# EAGLE design 2_disp (EAGLE 6.4)
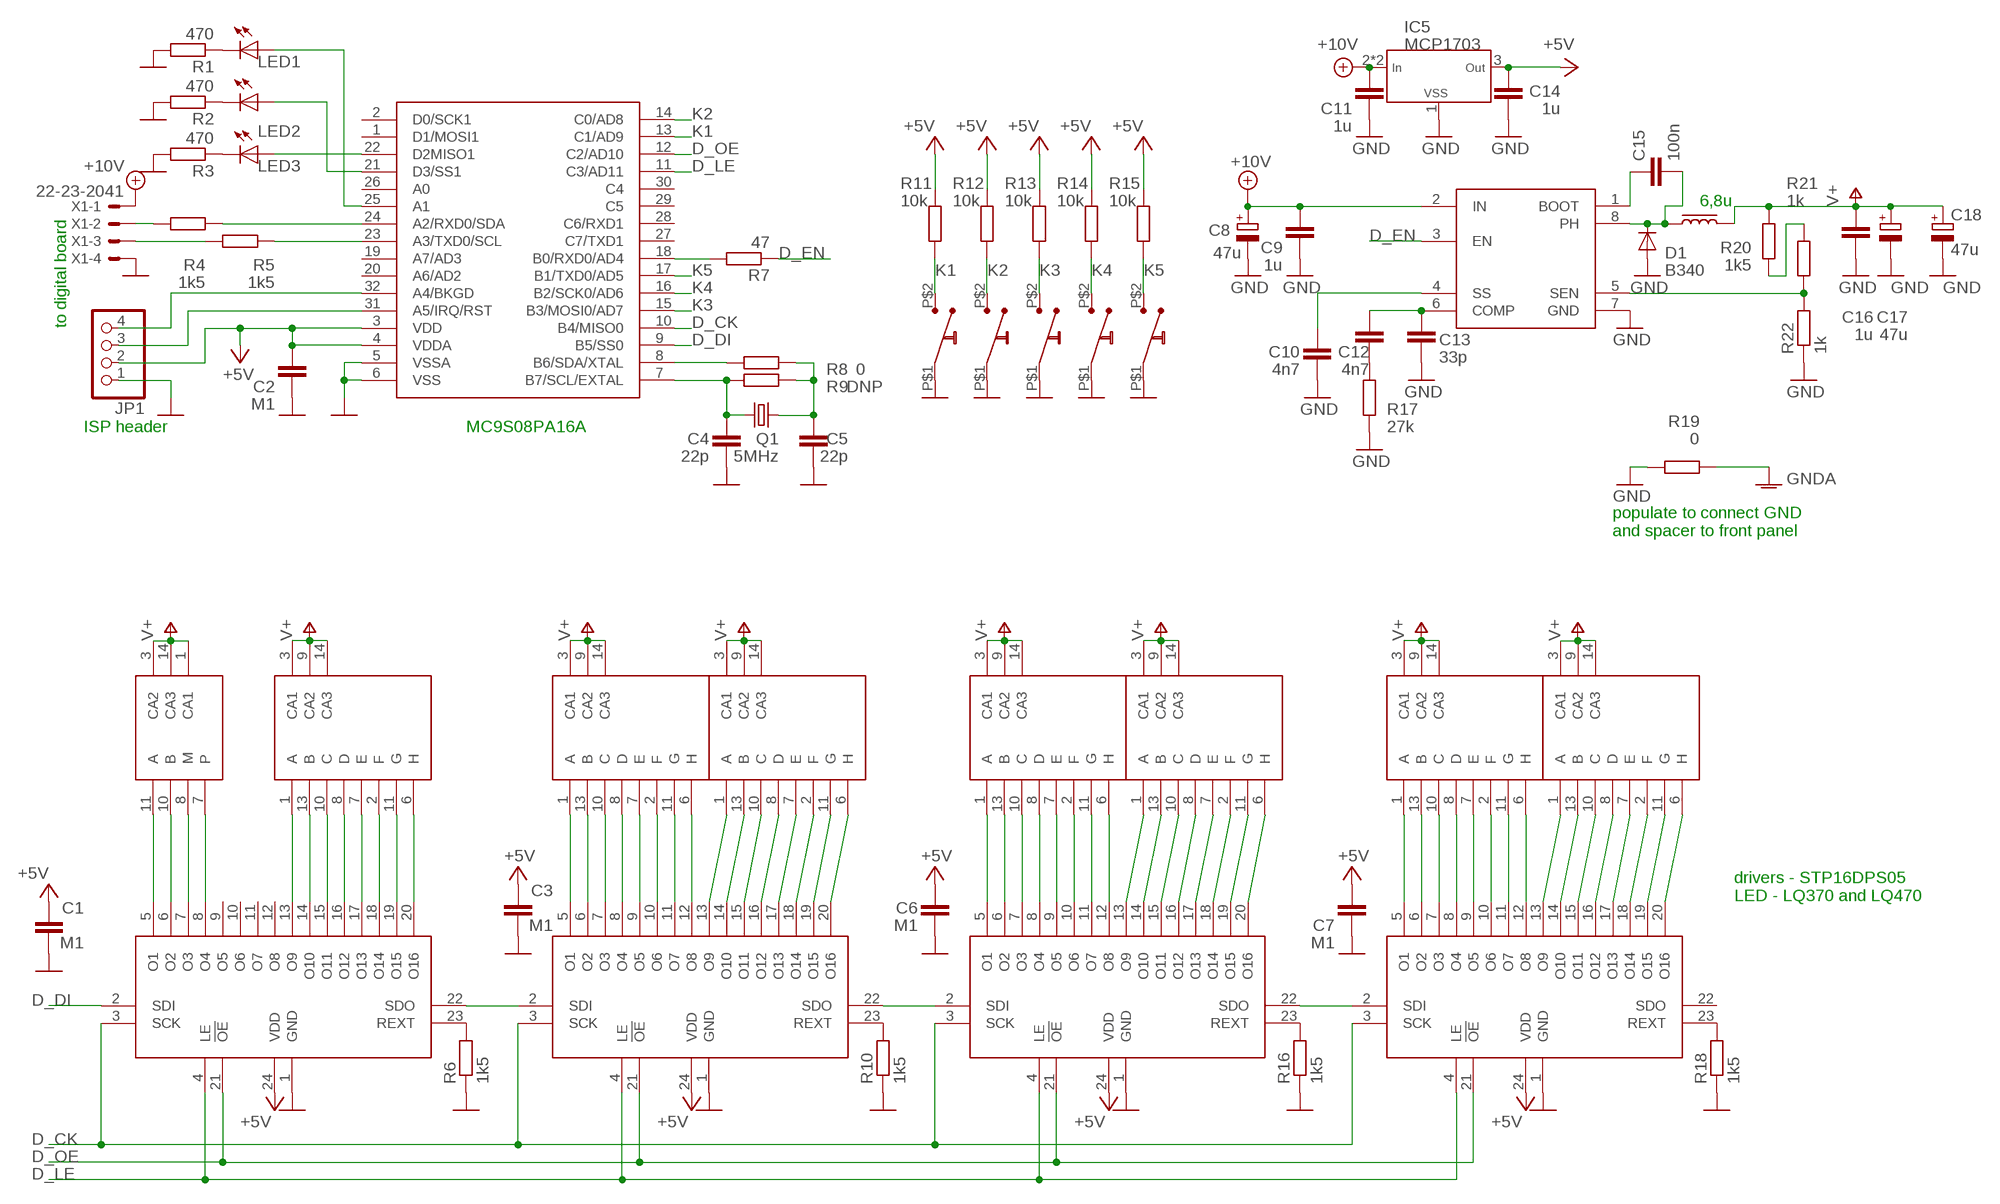
[diagram p0: schematic, sheet 1]

## Parts
C1  M1  C_0806  [R0805]
C2  M1  C_0806  [R0805]
C3  M1  C_0806  [R0805]
C4  22p  C_0806  [R0805]
C5  22p  C_0806  [R0805]
C6  M1  C_0806  [R0805]
C7  M1  C_0806  [R0805]
C8  47u  CPOL-EUSMCC  [SMC_C]
C9  1u  C_0806  [R0805]
C10  4n7  C_0806  [R0805]
C11  1u  C_0806  [R0805]
C12  4n7  C_0806  [R0805]
C13  33p  C_0806  [R0805]
C14  1u  C_0806  [R0805]
C15  100n  C_0806  [R0805]
C16  1u  C_0806  [R0805]
C17  47u  CPOL-EUSMCC  [SMC_C]
C18  47u  CPOL-EUSMCC  [SMC_C]
D1  B340  DIODE-SMB  [SMB]
DI1  LQ3XX  [LQ_DISP]
DI2  LQ4XX  [LQ_DISP]
DI3  LQ4XX  [LQ_DISP]
DI4  LQ4XX  [LQ_DISP]
DI5  LQ4XX  [LQ_DISP]
DI6  LQ4XX  [LQ_DISP]
DI7  LQ4XX  [LQ_DISP]
DI8  LQ4XX  [LQ_DISP]
IC1  STP16CPS05  [QSOP24]
IC2  MC9S08PT60TQ32  [TQFP32-8]
IC3  STP16CPS05  [QSOP24]
IC4  STP16CPS05  [QSOP24]
IC5  MCP1703  MCP1702-SOT89  [SOT89]
IC6  STP16CPS05  [QSOP24]
IC7  TPS54331  [SO-08]
JP1  PINHD-1X04_2.54  [1X04]
K1  SWITCH_MINI6450  [SWITCH_6450]
K2  SWITCH_MINI6450  [SWITCH_6450]
K3  SWITCH_MINI6450  [SWITCH_6450]
K4  SWITCH_MINI6450  [SWITCH_6450]
K5  SWITCH_MINI6450  [SWITCH_6450]
L1  SRP7030  INDUCTORBOURNS_SRP7030  [BOURNS_SRP7030]
LED1  LEDCHIPLED_0805  [CHIPLED_0805]
LED2  LEDCHIPLED_1206  [CHIPLED_1206]
LED3  LEDCHIPLED_1206  [CHIPLED_1206]
Q1  5MHz  CRYSTALTC38H  [TC38H]
R1  470  R_0805  [R0805]
R2  470  R_0805  [R0805]
R3  470  R_0805  [R0805]
R4  1k5  R_0805  [R0805]
R5  1k5  R_0805  [R0805]
R6  1k5  R_0805  [R0805]
R7  47  R_0805  [R0805]
R8  0  R_0805  [R0805]
R9  DNP  R_0805  [R0805]
R10  1k5  R_0805  [R0805]
R11  10k  R_0805  [R0805]
R12  10k  R_0805  [R0805]
R13  10k  R_0805  [R0805]
R14  10k  R_0805  [R0805]
R15  10k  R_0805  [R0805]
R16  1k5  R_0805  [R0805]
R17  27k  R_0805  [R0805]
R18  1k5  R_0805  [R0805]
R19  0  R_0805  [R0805]
R20  1k5  R_0805  [R0805]
R21  1k  R_0805  [R0805]
R22  1k  R_0805  [R0805]
X1  22-23-2041  [22-23-2041]

## Nets
+5V: C1.2 C2.2 C3.2 C6.2 C7.2 C14.2 IC1.24(VDD) IC2.3(VDD) IC2.4(VDDA) IC3.24(VDD) IC4.24(VDD) IC5.3(OUT) IC6.24(VDD) JP1.2 R11.1 R12.1 R13.1 R14.1 R15.1
+10V: C8.+ C9.2 C11.2 IC5.2(IN) IC5.2@1(IN) IC7.2(IN) X1.1
D_CK: IC1.3(SCK) IC2.10(B4/MISO0) IC3.3(SCK) IC4.3(SCK) IC6.3(SCK)
D_DI: IC1.2(SDI) IC2.9(B5/SS0)
D_EN: IC7.3(EN) R7.1
D_LE: IC1.4(LE) IC2.11(C3/AD11) IC3.4(LE) IC4.4(LE) IC6.4(LE)
D_OE: IC1.21(!OE) IC2.12(C2/AD10) IC3.21(!OE) IC4.21(!OE) IC6.21(!OE)
GND: C1.1 C2.1 C3.1 C4.1 C5.1 C6.1 C7.1 C8.- C9.1 C10.1 C11.1 C13.1 C14.1 C16.1 C17.- C18.- D1.A IC1.1(GND) IC2.5(VSSA) IC2.6(VSS) IC3.1(GND) IC4.1(GND) IC5.1(VSS) IC6.1(GND) IC7.7(GND) JP1.1 K1.P$1 K2.P$1 K3.P$1 K4.P$1 K5.P$1 R1.2 R2.2 R3.2 R6.1 R10.1 R16.1 R17.1 R18.1 R19.2 R22.1 X1.4
GNDA: R19.1
K1: IC2.13(C1/AD9) K1.P$2 R11.2
K2: IC2.14(C0/AD8) K2.P$2 R12.2
K3: IC2.15(B3/MOSI0/AD7) K3.P$2 R13.2
K4: IC2.16(B2/SCK0/AD6) K4.P$2 R14.2
K5: IC2.17(B1/TXD0/AD5) K5.P$2 R15.2
N$5: DI1.11(A) IC1.5(O1)
N$6: DI1.10(B) IC1.6(O2)
N$7: DI1.8(M) IC1.7(O3)
N$8: DI1.7(P) IC1.8(O4)
N$9: DI2.1(A) IC1.13(O9)
N$10: DI2.13(B) IC1.14(O10)
N$11: DI2.10(C) IC1.15(O11)
N$12: DI2.8(D) IC1.16(O12)
N$13: DI2.7(E) IC1.17(O13)
N$14: DI2.2(F) IC1.18(O14)
N$15: DI2.11(G) IC1.19(O15)
N$16: DI2.6(H) IC1.20(O16)
N$17: DI3.1(A) IC3.5(O1)
N$18: DI3.13(B) IC3.6(O2)
N$19: DI3.10(C) IC3.7(O3)
N$20: DI3.8(D) IC3.8(O4)
N$21: IC3.23(REXT) R10.2
N$22: DI3.7(E) IC3.9(O5)
N$23: DI3.2(F) IC3.10(O6)
N$24: DI3.11(G) IC3.11(O7)
N$25: DI3.6(H) IC3.12(O8)
N$26: DI4.1(A) IC3.13(O9)
N$27: DI4.13(B) IC3.14(O10)
N$28: DI4.10(C) IC3.15(O11)
N$29: DI4.8(D) IC3.16(O12)
N$30: DI4.7(E) IC3.17(O13)
N$31: DI4.2(F) IC3.18(O14)
N$32: DI4.11(G) IC3.19(O15)
N$33: DI4.6(H) IC3.20(O16)
N$34: DI5.1(A) IC4.5(O1)
N$35: DI5.13(B) IC4.6(O2)
N$36: DI5.10(C) IC4.7(O3)
N$37: DI5.8(D) IC4.8(O4)
N$38: IC4.23(REXT) R16.2
N$39: DI5.7(E) IC4.9(O5)
N$40: IC1.23(REXT) R6.2
N$41: DI5.2(F) IC4.10(O6)
N$42: DI5.11(G) IC4.11(O7)
N$43: DI5.6(H) IC4.12(O8)
N$44: DI6.1(A) IC4.13(O9)
N$45: DI6.13(B) IC4.14(O10)
N$46: DI6.10(C) IC4.15(O11)
N$47: DI6.8(D) IC4.16(O12)
N$48: DI6.7(E) IC4.17(O13)
N$49: DI6.2(F) IC4.18(O14)
N$50: DI6.11(G) IC4.19(O15)
N$51: DI6.6(H) IC4.20(O16)
N$52: DI7.1(A) IC6.5(O1)
N$53: DI7.13(B) IC6.6(O2)
N$54: DI7.10(C) IC6.7(O3)
N$55: DI7.8(D) IC6.8(O4)
N$56: IC6.23(REXT) R18.2
N$57: DI7.7(E) IC6.9(O5)
N$58: DI7.2(F) IC6.10(O6)
N$59: DI7.11(G) IC6.11(O7)
N$60: DI7.6(H) IC6.12(O8)
N$61: DI8.1(A) IC6.13(O9)
N$62: DI8.13(B) IC6.14(O10)
N$63: DI8.10(C) IC6.15(O11)
N$64: DI8.8(D) IC6.16(O12)
N$65: DI8.7(E) IC6.17(O13)
N$66: DI8.2(F) IC6.18(O14)
N$67: DI8.11(G) IC6.19(O15)
N$68: DI8.6(H) IC6.20(O16)
N$69: IC2.8(B6/SDA/XTAL) R8.2
N$70: C5.2 Q1.1 R8.1 R9.1
N$71: C4.2 IC2.7(B7/SCL/EXTAL) Q1.2 R9.2
N$72: IC2.18(B0/RXD0/AD4) R7.2
N$73: IC1.22(SDO) IC3.2(SDI)
N$74: IC3.22(SDO) IC4.2(SDI)
N$75: IC4.22(SDO) IC6.2(SDI)
N$76: LED2.C R2.1
N$77: IC2.23(A3/TXD0/SCL) R5.1
N$78: IC2.24(A2/RXD0/SDA) R4.1
N$79: R5.2 X1.3
N$80: R4.2 X1.2
N$81: IC2.32(A4/BKGD) JP1.4
N$82: IC2.31(A5/IRQ/RST) JP1.3
N$83: IC2.21(D3/SS1) LED2.A
N$84: LED1.C R1.1
N$85: C15.2 D1.C IC7.8(PH) L1.P$1
N$86: C15.1 IC7.1(BOOT)
N$87: IC2.25(A1) LED1.A
N$88: IC7.5(SEN) R21.1 R22.2
N$89: R20.1 R21.2
N$90: C12.1 R17.2
N$91: C12.2 C13.2 IC7.6(COMP)
N$92: C10.2 IC7.4(SS)
N$93: LED3.C R3.1
N$94: IC2.22(D2MISO1) LED3.A
V+: C16.2 C17.+ C18.+ DI1.1(CA1) DI1.3(CA2) DI1.14(CA3) DI2.3(CA1) DI2.9(CA2) DI2.14(CA3) DI3.3(CA1) DI3.9(CA2) DI3.14(CA3) DI4.3(CA1) DI4.9(CA2) DI4.14(CA3) DI5.3(CA1) DI5.9(CA2) DI5.14(CA3) DI6.3(CA1) DI6.9(CA2) DI6.14(CA3) DI7.3(CA1) DI7.9(CA2) DI7.14(CA3) DI8.3(CA1) DI8.9(CA2) DI8.14(CA3) L1.P$2 R20.2
Unconnected: IC1.9(O5) IC1.10(O6) IC1.11(O7) IC1.12(O8) IC2.1(D1/MOSI1) IC2.2(D0/SCK1) IC2.19(A7/AD3) IC2.20(A6/AD2) IC2.26(A0) IC2.27(C7/TXD1) IC2.28(C6/RXD1) IC2.29(C5) IC2.30(C4) IC6.22(SDO)

## Notes on the sheet
- 6,8u
- to digital board
- ISP header | MC9S08PA16A
- populate to connect GND 
  and spacer to front panel
- drivers - STP16DPS05
  LED - LQ370 and LQ470

## Library data of the parts
C1-C7 C9-C16 = _moja:C
C8 C17 C18 = _rcl:CPOL-EU: POLARIZED CAPACITOR, European symbol
D1 = diode:DIODE-: DIODE
DI1 = _jl4:LQ3XX
DI2-DI8 = _jl4:LQ4XX
IC1 IC3 IC4 IC6 = _moja:STP16CPS05
IC2 = _mcom6:MC9S08PT60
IC5 = _mcom6:MCP1702
IC7 = _mcom5:TPS54331
JP1 = pinhead-2:PINHD-1X04: PIN HEADER
K1-K5 = _moja:SWITCH_MINI
L1 = _mcs1:INDUCTOR
LED1-LED3 = led:LED: LED OSRAM: - CHIPLED LG R971, LG N971, LY N971, LG Q971, LY Q971, LO R971, LY R971 LH N974, LH R974 LS Q976, LO Q976, LY Q976 LO Q996 - Hyper CHIPLED LW Q18S LB Q993, LB Q99A, LB R99A - SideLED LS A670, LO A670, LY A670, LG A670, LP A670 LB A673, LV A673, LT A673, LW A673 LH A674 LY A675 LS A676, LA A676, LO A676, LY A676, LW A676 LS A679, LY A679, LG A679 - Hyper Micro SIDELED® LS Y876, LA Y876, LO Y876, LY Y876 LT Y87S - SmartLED LW L88C, LW L88S LB L89C, LB L89S, LG L890 LS L89K, LO L89K, LY L89K LS L896, LA L896, LO L896, LY L896 - TOPLED LS T670, LO T670, LY T670, LG T670, LP T670 LSG T670, LSP T670, LSY T670, LOP T670, LYG T670 LG T671, LOG T671, LSG T671 LB T673, LV T673, LT T673, LW T673 LH T674 LS T676, LA T676, LO T676, LY T676, LB T676, LH T676, LSB T676, LW T676 LB T67C, LV T67C, LT T67C, LS T67K, LO T67K, LY T67K, LW E67C LS E67B, LA E67B, LO E67B, LY E67B, LB E67C, LV E67C, LT E67C LW T67C LS T679, LY T679, LG T679 LS T770, LO T770, LY T770, LG T770, LP T770 LB T773, LV T773, LT T773, LW T773 LH T774 LS E675, LA E675, LY E675, LS T675 LS T776, LA T776, LO T776, LY T776, LB T776 LHGB T686 LT T68C, LB T68C - Hyper Mini TOPLED® LB M676 - Mini TOPLED Santana® LG M470 LS M47K, LO M47K, LY M47K Source: http://www.osram.convergy.de LUXEON: - LUMILED® LXK2-PW12-R00, LXK2-PW12-S00, LXK2-PW14-U00, LXK2-PW14-V00 LXK2-PM12-R00, LXK2-PM12-S00, LXK2-PM14-U00 LXK2-PE12-Q00, LXK2-PE12-R00, LXK2-PE12-S00, LXK2-PE14-T00, LXK2-PE14-U00 LXK2-PB12-K00, LXK2-PB12-L00, LXK2-PB12-M00, LXK2-PB14-N00, LXK2-PB14-P00, LXK2-PB14-Q00 LXK2-PR12-L00, LXK2-PR12-M00, LXK2-PR14-Q00, LXK2-PR14-R00 LXK2-PD12-Q00, LXK2-PD12-R00, LXK2-PD12-S00 LXK2-PH12-R00, LXK2-PH12-S00 LXK2-PL12-P00, LXK2-PL12-Q00, LXK2-PL12-R00 Source: www.luxeon.com KINGBRIGHT: KA-3528ASYC Source: www.kingbright.com
Q1 = crystal:CRYSTAL: CRYSTAL
R1-R22 = _moja:R
X1 = con-molex:22-23-2041: .100" (2.54mm) Center Header - 4 Pin; MF: MOLEX; MPN: 22-23-2041; OC_FARNELL: 1462920; OC_NEWARK: 38C0355

## Board
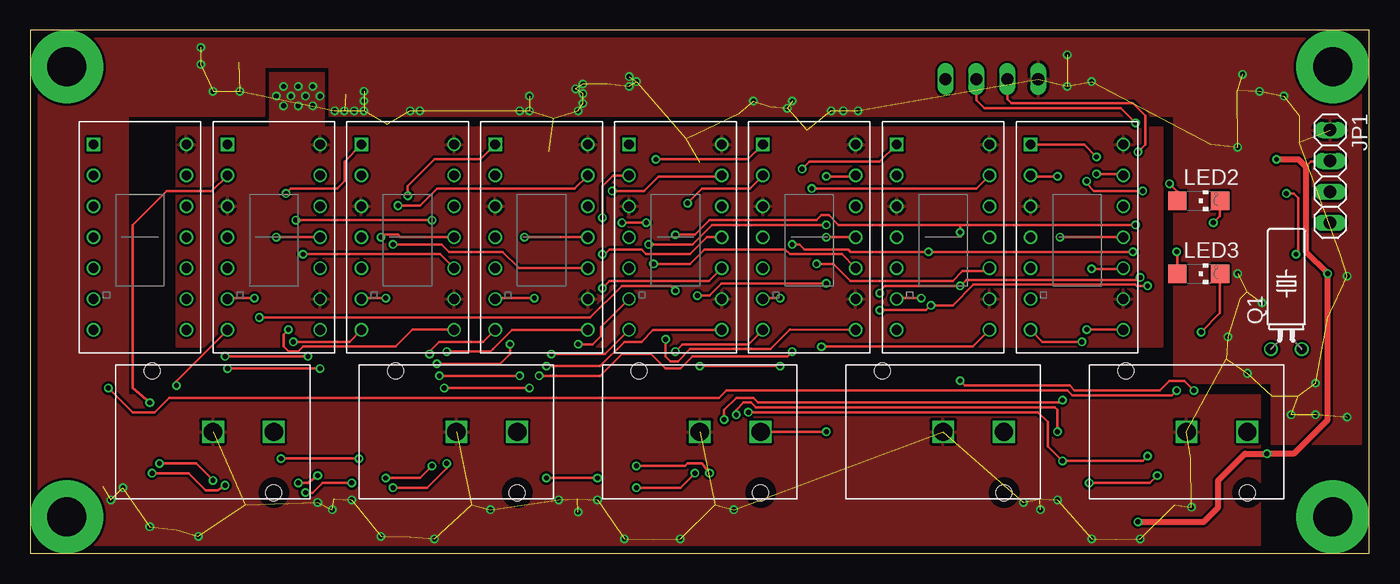
[diagram p1: board, top side]
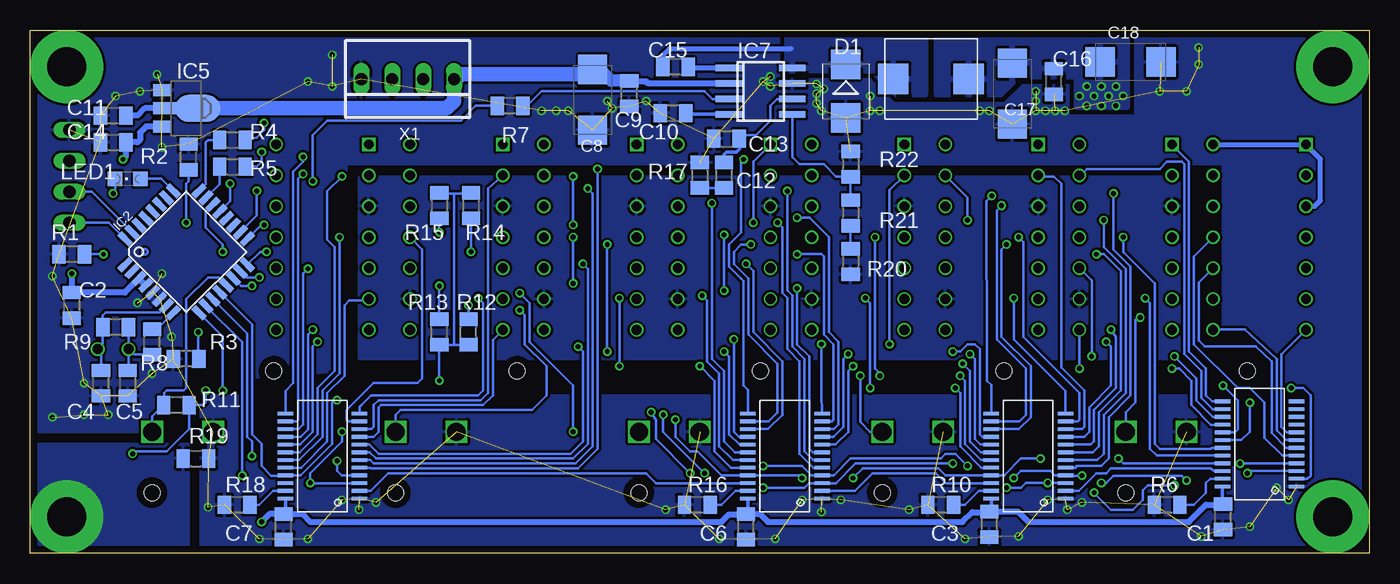
[diagram p2: board, bottom side, seen from below]

Size 110 x 43 mm. Coordinates in mm from the lower left corner, seen from the top.
Outline: 0,0 110,0 110,43 0,43 0,0
Copper layers (1*16): Top 0.035mm / dielectric 1.5mm / Bottom 0.035mm
Design rules "ch_6": minimum track width 0.15mm, minimum drill 0.4mm, track to track 0.2mm, track to pad 0.2mm, pad to pad 0.2mm, via to via 0.2mm, smd to smd 0.2mm, copper to edge 0.6mm, drill to drill 8mil, minimum pad ring 0.15mm, minimum via ring 0.15mm, stop-mask expansion 4mil, vias tented up to drill 0mil, thermal gap 10mil

### Footprints (pad centres in the part's own frame; a part is rotated, then mirrored left to right if it is on the bottom)
R0805 = smd 1.1 x 1.5: 1 -1.05,0; 2 1.05,0
SMC_C = smd 2.4 x 2.4: + -2.5,0; - 2.5,0
SMB = smd 2.4 x 2.4: A 2.2,0; C -2.2,0
LQ_DISP = drill 0.8 square: 1 -3.81,7.62 | drill 0.8: 2 -3.81,5.08; 3 -3.81,2.54; 4 -3.81,0; 5 -3.81,-2.54; 6 -3.81,-5.08; 7 -3.81,-7.62; 8 3.81,-7.62; 9 3.81,-5.08; 10 3.81,-2.54; 11 3.81,0; 12 3.81,2.54; 13 3.81,5.08; 14 3.81,7.62
QSOP24 = smd 0.305 x 1.27: 1 -3.493,-3.048; 2 -2.857,-3.048; 3 -2.223,-3.048; 4 -1.587,-3.048; 5 -0.953,-3.048; 6 -0.318,-3.048; 7 0.318,-3.048; 8 0.953,-3.048; 9 1.587,-3.048; 10 2.223,-3.048; 11 2.857,-3.048; 12 3.493,-3.048; 13 3.493,3.048; 14 2.857,3.048; 15 2.223,3.048; 16 1.587,3.048; 17 0.953,3.048; 18 0.318,3.048; 19 -0.318,3.048; 20 -0.953,3.048; 21 -1.587,3.048; 22 -2.223,3.048; 23 -2.857,3.048; 24 -3.493,3.048
TQFP32-8 = smd 1.3 x 0.5: 1 -4.293,2.8; 2 -4.293,2; 3 -4.293,1.2; 4 -4.293,0.4; 5 -4.293,-0.4; 6 -4.293,-1.2; 7 -4.293,-2; 8 -4.293,-2.8; 17 4.293,-2.8; 18 4.293,-2; 19 4.293,-1.2; 20 4.293,-0.4; 21 4.293,0.4; 22 4.293,1.2; 23 4.293,2; 24 4.293,2.8 | smd 0.5 x 1.3: 9 -2.8,-4.293; 10 -2,-4.293; 11 -1.2,-4.293; 12 -0.4,-4.293; 13 0.4,-4.293; 14 1.2,-4.293; 15 2,-4.293; 16 2.8,-4.293; 25 2.8,4.293; 26 2,4.293; 27 1.2,4.293; 28 0.4,4.293; 29 -0.4,4.293; 30 -1.2,4.293; 31 -2,4.293; 32 -2.8,4.293
SOT89 = smd 1 x 1.5: 1 -1.499,-1.981; 3 1.499,-1.981 | smd 1 x 2: 2 0,-1.727 | smd 2.2 x 3.7: 2@1 0,0.94
SO-08 = smd 0.55 x 2.2: 1 -1.905,-2.6; 2 -0.635,-2.6; 3 0.635,-2.6; 4 1.905,-2.6; 5 1.905,2.6; 6 0.635,2.6; 7 -0.635,2.6; 8 -1.905,2.6
1X04 = drill 1.016 long: 1 -3.81,0; 2 -1.27,0; 3 1.27,0; 4 3.81,0
SWITCH_6450 = drill 1.5 square: P$1 0,0; P$2 5,0 | hole 1.3: 5,-5; -5,5
BOURNS_SRP7030 = smd 2.5 x 2.5: P$1 3.1,0; P$2 -3.1,0
CHIPLED_0805 = smd 1.2 x 1.2: A 0,-1.05; C 0,1.05
CHIPLED_1206 = smd 1.5 x 1.5: A 0,-1.75; C 0,1.75
TC38H = drill 0.813: 1 -1.27,0; 2 1.27,0
22-23-2041 = drill 1 long: 1 -3.81,0; 2 -1.27,0; 3 1.27,0; 4 3.81,0

### Placement (x,y rotation side)
C1  12,3 90 bottom
C2  106.6,20.4 90 bottom
C3  31.2,2.4 90 bottom
C4  104.2,14 90 bottom
C5  102,14 90 bottom
C6  51.2,2.2 90 bottom
C7  89.2,2.2 90 bottom
C8  63.8,37.3 270 bottom
C9  60.8,37.8 90 bottom
C10  57.2,36.2 0 bottom
C11  103.2,36 0 bottom
C12  53,31.1 90 bottom
C13  52.8,34.1 0 bottom
C14  103.2,33.8 0 bottom
C15  57,40 180 bottom
C16  25.9,38.8 90 bottom
C17  29.3,37.8 270 bottom
C18  19.6,40.4 0 bottom
D1  43,38 270 bottom
DI1  9,26 0 top
DI2  20,26 0 top
DI3  31,26 0 top
DI4  42,26 0 top
DI5  53,26 0 top
DI6  64,26 0 top
DI7  75,26 0 top
DI8  86,26 0 top
IC1  9,9 90 bottom
IC2  97.2,24.8 45 bottom
IC3  28,8 90 bottom
IC4  48,8 90 bottom
IC5  97.2,36.6 270 bottom
IC6  86,8 90 bottom
IC7  50,38 270 bottom
JP1  106.8,31 270 top
K1  95,10 0 top
K2  75,10 0 top
K3  55,10 0 top
K4  35,10 0 top
K5  15,10 0 top
L1  36,39 180 bottom
LED1  102,30.8 90 bottom
LED2  96,29 270 top
LED3  96,23 270 top
Q1  103.2,16.8 0 top
R1  106.6,24.6 180 bottom
R2  97,32.6 90 bottom
R3  97.2,16 180 bottom
R4  93.4,34 0 bottom
R5  93.4,31.8 0 bottom
R6  16.6,4 0 bottom
R7  70.6,36.8 180 bottom
R8  100,17.4 90 bottom
R9  103,18.6 180 bottom
R10  35.2,4 0 bottom
R11  98,12.2 180 bottom
R12  74,18.2 90 bottom
R13  76.4,18.2 90 bottom
R14  73.8,28.6 270 bottom
R15  76.4,28.6 270 bottom
R16  55.2,4 0 bottom
R17  55,31.1 270 bottom
R18  93,4 0 bottom
R19  96.4,7.8 0 bottom
R20  42.6,24 270 bottom
R21  42.6,28 270 bottom
R22  42.6,32 270 bottom
X1  79,39 180 bottom

### Tracks (layer width: path | path; a pad name or v marks a point on that pad's centre or on a via)
+5V  (via drill 0.4)
  Top 0.2: 104.8,31.8 105.2,32.2 106.73,32.2 JP1.2 | v76.4,14.2 76.8,13.8 85.4,13.8 85.8,13.4 92.8,13.4 93.6,14.2 94.8,14.2 v95.6,13.4
  Top 0.5: v102.4,32.4 104.2,32.4 104.8,31.8 104.8,24.8 v106.6,23 106.6,11 103.8,8.2 v101.6,8.2 99.8,8.2 97.6,6 97.6,3.8 96.4,2.6 v91,2.6
  Bottom 0.2: 51.25,3.2 C6.2 51.05,3.4 | 31.25,3.4 C3.2 31.05,3.6 | 12.05,4 C1.2 12.05,4.1 | 89.05,3.4 C7.2 | R12.1 75.15,17.15 75.2,17.2 | 75.2,17.2 75.2,29.6 | 75.2,29.6 76.35,29.6 R15.1 | 75.2,29.6 73.85,29.6 R14.1 | v76.4,14.2 R13.1 75.25,17.15 75.2,17.2 | v95.6,13.4 95.6,12.4 95.8,12.2 R11.1 96.95,10.25 98.8,8.4 101.4,8.4 v101.6,8.2
  Bottom 0.3: IC1.24 12.05,4.1 | IC3.24 31.05,3.6 | IC4.24 51.05,3.4 | IC6.24 89.05,3.4
  Bottom 0.5: IC5.3 100.5,35.1 101,34.6 101,34 101.2,33.8 C14.2 102.15,32.65 v102.4,32.4 | v106.6,23 C2.2 102.25,21.45 IC2.3 IC2.4 | 51.25,3.2 52.6,3.2 53.2,2.6 87,2.6 87.65,3.25 C7.2 90.35,3.25 v91,2.6 | C6.2 50.05,3.25 49.4,2.6 33.4,2.6 32.6,3.4 31.25,3.4 | C3.2 28.85,3.45 28,2.6 14.8,2.6 13.4,4 12.05,4
+10V
  Bottom 0.2: 60.75,38.8 C9.2 | 63.2,39.8 C8.+ | X1.1 | IC5.2@1 IC5.2
  Bottom 0.5: IC7.2 59.23,38.63 59.4,38.8 60.75,38.8 | IC5.2 100.6,36.6 101.2,36 C11.2
  Bottom 1: C9.2 62.25,38.85 63.2,39.8 | X1.1 75,39 | 64.8,39.4 64.2,39.8 C8.+
  Bottom 1.2: 75,39 74.6,39.4 64.8,39.4 | IC5.2@1 75.8,36.6 75.2,37.2 X1.1
D_CK  (via drill 0.4)
  Top 0.2: v87,5.8 92,5.8 v92.6,6.4 | v10,6.6 13,6.6 14.4,5.2 15.4,5.2 v16,5.6 | v22.6,5 23.2,5 24,5.8 v26.4,5.8 | v34.2,7.4 34.2,7 32.6,5.4 v29.8,5.4 | v49.8,5.4 53.4,5.4 v54.6,6.6 | v58,11.4 58,11.8 58.6,12.4 59.2,12.4 59.6,12 84.2,12 84.4,11.8 v84.4,10
  Bottom 0.2: IC2.10 92.6,17.37 v92.6,6.4 | IC6.3 86.98,5.78 v87,5.8 87,6.6 84.4,9.2 v84.4,10 | IC1.3 9.82,6.78 v10,6.6 | v16,5.6 18.2,5.6 18.6,5.2 18.6,4.4 19.4,3.6 21.2,3.6 v22.6,5 | IC3.3 24.97,5.8 v26.4,5.8 28.2,5.8 28.6,5.4 v29.8,5.4 | v34.2,7.4 42.2,7.4 43.82,5.78 IC4.3 46.02,5.78 46.4,5.4 v49.8,5.4 | v54.6,6.6 58,10 v58,11.4
D_DI  (via drill 0.4)
  Top 0.2: v6.4,13.6 8.4,11.6 10.2,11.6 11.4,12.8 56.6,12.8 57.2,13.4 85.2,13.4 85.6,13 93.8,13 v94.2,13.4
  Bottom 0.2: IC2.9 94.2,17.84 v94.2,13.4 | IC1.2 5.06,6.14 4.8,6.4 4.8,13 5.4,13.6 v6.4,13.6
D_EN
  Bottom 0.2: IC7.3 53.97,37.37 54.6,38 68,38 69.2,36.8 R7.1
D_LE  (via drill 0.4)
  Top 0.2: v10.6,7.4 13.6,7.4 v15,6 | v22,5.8 22.8,5.8 v23.6,6.4 | v29.2,6.2 32,6.2 v33,7.2 | v49.8,7.2 53.8,7.2 54,7.4 55.2,7.4 v55.8,6.6 | v59,11.6 82.8,11.6 83.6,10.8 83.6,8.8 v84.8,7.6 91.4,7.6 v91.8,8
  Bottom 0.2: IC2.11 92.2,18.1 92.2,9.6 91.8,9.2 v91.8,8 | IC1.4 10.59,7.41 v10.6,7.4 | v15,6 15.4,6.4 21,6.4 21.6,5.8 v22,5.8 | v23.6,6.4 IC3.4 25.81,6.41 26.2,6.8 28.6,6.8 v29.2,6.2 | v33,7.2 34,8.2 34.8,8.2 35.2,7.8 42.6,7.8 43.99,6.41 IC4.4 45.81,6.41 46.6,7.2 v49.8,7.2 | v55.8,6.6 58.6,9.4 58.6,11 v59,11.6 | v84.8,7.6 84.8,6.8 84.41,6.41 IC6.4
D_OE  (via drill 0.4)
  Top 0.2: v20.6,7.8 v27,7.8 | v42.4,6.2 v46.6,6.2 | v57,11 57,11.8 58,12.8 59.4,12.8 59.8,12.4 84.6,12.4 v84.8,12.6
  Bottom 0.2: IC2.12 91.8,18.83 91.8,9.8 91,9 91,7.2 90.2,6.4 89.06,6.4 IC6.21 87.79,6.41 85.2,9 85.2,12.4 85,12.6 v84.8,12.6 | IC1.21 20.21,7.41 v20.6,7.8 | v27,7.8 28.6,7.8 29.99,6.41 IC3.21 34.81,6.41 35.4,7 41.6,7 v42.4,6.2 | v46.6,6.2 46.81,6.41 IC4.21 53.21,6.41 55.2,8.4 55.8,8.4 57,9.6 v57,11
GND  (via drill 0.4)  (108 unrouted)
  other vias: 14,41.6 25,36.4 41,36.4 41,37.6 45.4,37 45,36.4 44.8,38.2 45.4,38.6 49.2,39.2 49.2,38.4 62.6,37.2 59.4,37.2 62.2,36.6 65.8,36.4 66.8,36.4 68,36.4 7.6,5.4 6.6,4.4 23.6,4.2 24.8,3.6 26.4,4.4 43.4,4.4 45,3.4 46.6,4.4 81.6,4.2 83,3.6 84.4,4.4 9.8,2.2 13.8,1.4 28.8,1.4 33.2,1.2 48.8,1.2 53.4,1.2 87.2,1.2 91.2,1.2 95.4,3.8 57.8,3.6 37.8,3.6 101,38 99.6,39.4 103,37.6 99.2,33.4 99.2,23 101.2,20.6 103.6,11.4 105.6,14 105.6,11.4 98.4,17.8 100,14.8 108.2,22.8 108.2,11.2 85.2,41 87.2,38.8 85.2,38.4 45.4,37.8 49.8,38.8 40.2,36.4 14,40.2 15,38 17.2,38 25.8,36.4 26.6,36.4 27.4,37.2 31.2,36.4 32,36.4 27.4,36.4 27.4,38
  pour Top: 0,43 0,0 101,0 101,13 8,13 8,36 19.2,36 19.2,40 24.6,40 24.6,36 94,36 94,14 102,14 102,9 110,9 110,43
  pour Bottom: 110,43 48.5,43 48.5,39 41,39 39,37 30,37 28.5,38.5 24.7,38.5 24.7,36 19.2,36 19.2,43 0,43 0,0 96,0 96,13 12,13 12,32 84,32 84,15 97,14 97,10 110,10
GNDA  (via drill 3.2 pad 6)
  other vias: 107,3
  pour Bottom: 97,0 110,0 110,9 97,9
K1
  Bottom 0.2: IC2.13 94.53,22.7 95.4,22.7 97.2,20.9 97.2,13.6 97.4,13.4 98.8,13.4 99,13.2 99,12.25 R11.2 100,11.25 K1.P$2
K2  (via drill 0.4)
  Top 0.2: v91.8,22 90.9,22 90.8,22.1 77.5,22.1 75.8,20.4 v74,20.4 73.6,20 v69.8,20
  Bottom 0.2: IC2.14 92.7,22 v91.8,22 | K2.P$2 80,11.4 79.6,11.8 68.8,11.8 67.6,13 67.6,15.4 69.4,17.2 69.4,19.6 v69.8,20 | R12.2 v74,20.4
K3  (via drill 0.4)
  Top 0.2: v91.2,22.7 91,22.5 76.9,22.5 v76.4,22 70.2,22 69.8,21.6 v69.8,21.4 | K3.P$2 v65.4,10
  Bottom 0.2: IC2.15 92.27,22.7 v91.2,22.7 | v65.4,10 65.4,13.8 69,17.4 69,20.6 v69.8,21.4 | R13.2 v76.4,22
K4  (via drill 0.4)
  Top 0.2: v90.6,24.8 v73.8,24.8 67.4,24.8 67.2,25 63.6,25 63.2,25.4 v62.6,25.4 | v41.8,14.6 46.8,14.6 48.6,16.4 51,16.4 52.2,15.2 53.4,15.2 54.4,16.2 62.2,16.2 v62.6,16.6
  Bottom 0.2: IC2.16 91.13,24.8 v90.6,24.8 | K4.P$2 41,10 41.8,10.8 v41.8,14.6 | v62.6,16.6 v62.6,25.4 | R14.2 v73.8,24.8
K5  (via drill 0.4)
  Top 0.2: v90.8,27 76.4,27 | 76.4,27 66.4,27 65.6,27.8 65,27.8 64.6,27.4 55.8,27.4 54.6,26.2 v53,26.2 | v53,21.6 52.6,22 48.6,22 46,19.4 v18.8,19.4 | v76.4,26.4 76.4,27
  Bottom 0.2: IC2.17 91.04,27 v90.8,27 | K5.P$2 20,11.6 19.2,12.4 19.2,19.2 v18.8,19.4 | v53,21.6 v53,26.2 | R15.2 v76.4,26.4
N$1  (via drill 3.2 pad 6)
  other vias: 3,40
N$2  (via drill 3.2 pad 6)
  other vias: 107,40
N$3  (via drill 3.2 pad 6)
  other vias: 3,3
N$5
  Bottom 0.2: IC1.5 7.15,8.05 8.6,9.5 8.6,12.4 9.8,13.6 10.8,13.6 14.4,17.2 14.4,24.41 DI1.11
N$6
  Bottom 0.2: IC1.6 6.78,8.68 8,9.9 8,15.8 9.3,17 13.5,17 14,17.5 14,22.27 DI1.10
N$7
  Bottom 0.2: IC1.7 6.82,9.32 7.6,10.1 7.6,16 10.2,18.4 12.79,18.4 DI1.8
N$8
  Bottom 0.2: IC1.8 6.75,9.95 7.2,10.4 7.2,16.37 DI1.7
N$9
  Bottom 0.2: IC1.13 12.89,12.49 13.4,13 13.4,15.2 14.8,16.6 14.8,32.23 DI2.1
N$10
  Bottom 0.2: IC1.14 12.86,11.86 13.8,12.8 13.8,15 15.2,16.4 15.2,32 15.4,32.2 16.6,32.2 17.2,31.6 23.2,31.6 23.72,31.08 DI2.13
N$11  (via drill 0.4)
  Top 0.2: v16,16.2 v22.8,16.2
  Bottom 0.2: IC1.15 12.82,11.22 14.2,12.6 14.2,14.4 v16,16.2 | v22.8,16.2 22.8,22.45 DI2.10
N$12  (via drill 0.4)
  Top 0.2: v16.2,15.2 v23.8,15.2
  Bottom 0.2: IC1.16 12.99,10.59 14.6,12.2 14.6,14.2 15.6,15.2 v16.2,15.2 | v23.8,15.2 DI2.8
N$13  (via drill 0.4)
  Top 0.2: v12,13.8 12,14.19 DI2.7
  Bottom 0.2: IC1.17 11.05,9.95 10.8,10.2 10.8,12.6 v12,13.8
N$14  (via drill 0.4)
  Top 0.2: v9.8,12.4 8.4,13.6 8.4,27 11.2,29.8 14.91,29.8 DI2.2
  Bottom 0.2: IC1.18 10.48,9.32 9.8,10 v9.8,12.4
N$15  (via drill 0.4)
  Top 0.2: v20.2,26 DI2.11
  Bottom 0.2: IC1.19 12.92,8.68 13,8.6 17.2,8.6 17.6,9 17.6,22.2 20.2,24.8 v20.2,26
N$16  (via drill 0.4)
  Top 0.2: v18.4,21 16.27,21 DI2.6
  Bottom 0.2: IC1.20 17.45,8.05 18,8.6 18,20.6 v18.4,21
N$17  (via drill 0.4)
  Top 0.2: v21,29.6 21.4,30 25.2,30 25.8,30.6 25.8,32.23 DI3.1
  Bottom 0.2: IC3.5 24.15,7.05 24,7.2 22,7.2 21.4,7.8 21.4,11.2 19.6,13 19.6,23.6 21,25 v21,29.6
N$18  (via drill 0.4)
  Top 0.2: v21.8,27.4 v33,27.4
  Bottom 0.2: IC3.6 22.32,7.68 21.8,8.2 21.8,11.4 20,13.2 20,23.4 21.8,25.2 v21.8,27.4 | v33,27.4 33,29.27 DI3.13
N$19  (via drill 0.4)
  Top 0.2: v22.4,24.6 33.67,24.6 DI3.10
  Bottom 0.2: IC3.7 22.68,8.32 22.2,8.8 22.2,11.6 20.4,13.4 20.4,23.2 21.8,24.6 v22.4,24.6
N$20  (via drill 0.4)
  Top 0.2: v21.2,18.4 20.8,18 20.8,17 21.2,16.6 22,16.6 22.4,17 30,17 31.4,18.4 34.8,18.4 DI3.8
  Bottom 0.2: IC3.8 22.85,8.95 22.6,9.2 22.6,11.8 20.8,13.6 20.8,17.8 v21.2,18.4
N$21
  Bottom 0.2: IC3.23 32.06,5.14 33.2,4 R10.2
N$22  (via drill 0.4)
  Top 0.2: v21.6,17.4 26.21,17.4 DI3.7
  Bottom 0.2: IC3.9 23.41,9.59 23,10 23,12 21.2,13.8 21.2,17 v21.6,17.4
N$23
  Bottom 0.2: IC3.10 23.58,10.22 23.4,10.4 23.4,13.4 25.3,15.3 25.3,30.4 25.9,31 27.11,31 DI3.2
N$24  (via drill 0.4)
  Top 0.2: v28.8,26 29,26.2 30.2,26.2 30.4,26 DI3.11
  Bottom 0.2: IC3.11 23.94,10.86 23.8,11 23.8,13.2 28.4,17.8 28.4,25.6 v28.8,26
N$25  (via drill 0.4)
  Top 0.2: v29.2,21 27.27,21 DI3.6
  Bottom 0.2: IC3.12 24.95,13.35 29.2,17.6 v29.2,21
N$26  (via drill 0.4)
  Top 0.2: v31,29.4 31,30.2 33.2,32.4 36.97,32.4 DI4.1
  Bottom 0.2: IC3.13 31.05,13.85 31.4,14.2 31.4,16 31.45,28.95 v31,29.4
N$27  (via drill 0.4)
  Top 0.2: v30.2,28.6 32,28.6 33.4,30 44.73,30 DI4.13
  Bottom 0.2: IC3.14 28.74,10.86 28.2,11.4 28.2,15.2 30.6,17.6 30.6,28.2 v30.2,28.6
N$28  (via drill 0.4)
  Top 0.2: v29.8,25.4 33.8,25.4 34.4,24.8 38.8,24.8 40.14,23.46 DI4.10
  Bottom 0.2: IC3.15 28.78,10.22 27.8,11.2 27.8,15.4 30.2,17.8 30.2,25 v29.8,25.4
N$29  (via drill 0.4)
  Top 0.2: v34.2,16.6 37.8,16.6 38,16.8 39.58,18.38 DI4.8
  Bottom 0.2: IC3.16 31.79,9.59 32,9.8 32,16.8 32.4,17.2 33,17.2 33.6,16.6 v34.2,16.6
N$30  (via drill 0.4)
  Top 0.2: v32.8,16.4 32.8,16.6 33.6,17.4 37.21,17.4 DI4.7
  Bottom 0.2: IC3.17 31.95,8.95 32.4,9.4 32.4,16 v32.8,16.4
N$31  (via drill 0.4)
  Top 0.2: v33.4,15.6 38.6,15.6 39.4,16.4 v39.4,17.2
  Bottom 0.2: IC3.18 31.92,8.32 32.8,9.2 32.8,15 v33.4,15.6 | v39.4,17.2 39.4,29.87 DI4.2
N$32  (via drill 0.4)
  Top 0.2: v33.6,14.6 v40.2,14.6 | v40.6,26 DI4.11
  Bottom 0.2: IC3.19 31.88,7.68 33.2,9 33.2,14.2 v33.6,14.6 | v40.2,14.6 40.2,14.8 40.6,15.2 v40.6,26
N$33  (via drill 0.4)
  Top 0.2: v34,13.6 v41,13.6 | v41.4,21 38.27,21 DI4.6
  Bottom 0.2: IC3.20 31.85,7.05 33.6,8.8 33.6,13.2 v34,13.6 | v41,13.6 41,20.6 v41.4,21
N$34  (via drill 0.4)
  Top 0.2: v48.6,27.2 v50.6,27.2
  Bottom 0.2: IC4.5 45.65,7.05 46.8,8.2 46.8,15.8 47.8,16.8 47.8,21 48.2,21.4 48.2,26.8 v48.6,27.2 | v50.6,27.2 50.6,32.21 DI5.1
N$35  (via drill 0.4)
  Top 0.2: v47.8,29.8 50.4,29.8 51.6,31 56.73,31 DI5.13
  Bottom 0.2: IC4.6 45.68,7.68 46.4,8.4 46.4,16 47.4,17 47.4,21.2 47.8,21.6 v47.8,29.8
N$36  (via drill 0.4)
  Top 0.2: v47,21.8 47.6,22.4 55.75,22.4 DI5.10
  Bottom 0.2: IC4.7 45.72,8.32 46,8.6 46,16.2 47,17.2 v47,21.8
N$37  (via drill 0.4)
  Top 0.2: v42.4,15.4 46.8,15.4 48.8,17.4 50.2,17.4 51.18,18.38 DI5.8
  Bottom 0.2: IC4.8 43.85,8.95 42.8,10 42.8,15 v42.4,15.4
N$38
  Bottom 0.2: IC4.23 52.06,5.14 53.2,4 R16.2
N$39  (via drill 0.4)
  Top 0.2: v42.8,16.4 47.21,16.4 DI5.7
  Bottom 0.2: IC4.9 44.01,9.59 43.2,10.4 43.2,16 v42.8,16.4
N$40
  Bottom 0.2: IC1.23 13.06,6.14 13.4,5.8 13.4,5 14.4,4 R6.2
N$41  (via drill 0.4)
  Top 0.2: v47,27.6 47,30.2 47.88,31.08 DI5.2
  Bottom 0.2: IC4.10 43.98,10.22 43.6,10.6 43.6,17.4 44.4,18.2 44.4,26 46,27.6 v47,27.6
N$42  (via drill 0.4)
  Top 0.2: v47,24.6 47.2,24.6 47.6,25 50.2,25 50.6,24.6 54.21,24.6 54.21,24.61 55.6,26 DI5.11
  Bottom 0.2: IC4.11 44.14,10.86 44,11 44,17.2 44.8,18 44.8,24.4 45,24.6 v47,24.6
N$43  (via drill 0.4)
  Top 0.2: v45,17.2 46.2,17.2 46.87,17.87 46.87,18.6 DI5.6
  Bottom 0.2: IC4.12 44.95,12.25 45,12.4 v45,17.2
N$44  (via drill 0.4)
  Top 0.2: v51.4,32.4 58.97,32.4 DI6.1
  Bottom 0.2: IC4.13 51.05,13.45 51.4,13.8 51.4,22.4 51.6,22.6 52.6,23.6 52.6,25.4 51.6,26.4 51.6,32.2 v51.4,32.4
N$45  (via drill 0.4)
  Top 0.2: v50.8,25.4 54.4,25.4 56,27 v65.4,27 | v65.4,31 67.73,31 DI6.13
  Bottom 0.2: IC4.14 49.34,10.86 48.6,11.6 48.6,15.6 51,18 51,22.6 52.2,23.8 52.2,24.8 51.6,25.4 v50.8,25.4 | v65.4,27 v65.4,31
N$46  (via drill 0.4)
  Top 0.2: v51.2,23.8 54.2,23.8 55.4,25 62,25 62.4,24.6 66.67,24.6 DI6.10
  Bottom 0.2: IC4.15 49.38,10.22 48.2,11.4 48.2,15.8 50.6,18.2 50.6,23.2 v51.2,23.8
N$47  (via drill 0.4)
  Top 0.2: v52.2,17.6 52.2,16.2 52.6,15.8 53.2,15.8 54.2,16.8 60.8,16.8 62.4,18.4 DI6.8
  Bottom 0.2: IC4.16 51.79,9.59 52.2,10 v52.2,17.6
N$48  (via drill 0.4)
  Top 0.2: v53,16.6 53.6,17.2 59.01,17.2 DI6.7
  Bottom 0.2: IC4.17 51.75,8.95 52.6,9.8 52.6,16.2 v53,16.6
N$49  (via drill 0.4)
  Top 0.2: v54,28.8 55.2,30 59.11,30 DI6.2
  Bottom 0.2: IC4.18 52.12,8.32 53,9.2 53,15 54,16 v54,28.8
N$50  (via drill 0.4)
  Top 0.2: v54.8,21.2 55.8,21.2 56.8,22.2 v65.4,22.2 | v65.4,26 DI6.11
  Bottom 0.2: IC4.19 52.28,7.68 53.4,8.8 53.4,14.8 54.4,15.8 54.4,20.8 v54.8,21.2 | v65.4,22.2 v65.4,26
N$51  (via drill 0.4)
  Top 0.2: v55,15.4 v61.6,15.4 | v61.6,21 60.27,21 DI6.6
  Bottom 0.2: IC4.20 52.45,7.05 53.8,8.4 53.8,14.2 v55,15.4 | v61.6,15.4 v61.6,21
N$52  (via drill 0.4)
  Top 0.2: v63.4,31.6 64,32.2 69.77,32.2 DI7.1
  Bottom 0.2: IC6.5 82.05,7.05 82,7 65,7 63.4,8.6 v63.4,31.6
N$53  (via drill 0.4)
  Top 0.2: v64.2,30 77.73,30 DI7.13
  Bottom 0.2: IC6.6 82.08,7.68 81.8,7.4 65.2,7.4 63.8,8.8 63.8,29.6 v64.2,30
N$54  (via drill 0.4)
  Top 0.2: v64.6,23.8 66,23.8 67.4,22.4 75.8,22.4 76.6,23.2 78.55,23.2 DI7.10
  Bottom 0.2: IC6.7 82.12,8.32 81.6,7.8 65.4,7.8 64.2,9 64.2,23.4 v64.6,23.8
N$55  (via drill 0.4)
  Top 0.2: v65,17 77.43,17 DI7.8
  Bottom 0.2: IC6.8 82.15,8.95 81.4,8.2 65.6,8.2 64.6,9.2 64.6,16.6 v65,17
N$56
  Bottom 0.2: IC6.23 90.06,5.14 91.2,4 R18.2
N$57
  Bottom 0.2: IC6.9 81.81,9.59 81.4,10 81.4,12 81.2,12.2 72.8,12.2 72,13 72,17.57 DI7.7
N$58
  Bottom 0.2: IC6.10 81.98,10.22 81.8,10.4 81.8,12.2 81.4,12.6 73,12.6 72.4,13.2 72.4,30 71.27,31 DI7.2
N$59
  Bottom 0.2: IC6.11 83.86,10.86 84,11 84,11.8 81.8,14 78.2,14 77.8,14.4 77.8,24.99 DI7.11
N$60  (via drill 0.4)
  Top 0.2: v73.2,21 71.27,21 DI7.6
  Bottom 0.2: IC6.12 82.95,12.05 82.91,12.09 82.8,12.2 82,13 73.2,13 72.8,13.4 72.8,20.6 v73.2,21
N$61  (via drill 0.4)
  Top 0.2: v87.6,32.6 86.6,33.6 82.21,33.6 DI8.1
  Bottom 0.2: IC6.13 89.05,13.35 88.4,14 88.4,31.4 87.6,32.2 v87.6,32.6
N$62  (via drill 0.4)
  Top 0.2: v87.6,31.2 89.69,31.2 DI8.13
  Bottom 0.2: IC6.14 88.14,10.86 88,11 88,30.8 v87.6,31.2
N$63  (via drill 0.4)
  Top 0.2: v87.2,23.4 89.75,23.4 DI8.10
  Bottom 0.2: IC6.15 87.98,10.22 87.6,10.6 87.6,23 v87.2,23.4
N$64  (via drill 0.4)
  Top 0.2: v86.8,18.4 89.79,18.4 DI8.8
  Bottom 0.2: IC6.16 87.81,9.59 87.2,10.2 87.2,18 v86.8,18.4
N$65  (via drill 0.4)
  Top 0.2: v86.4,17.4 83.17,17.4 DI8.7
  Bottom 0.2: IC6.17 87.85,8.95 86.8,10 86.8,17 v86.4,17.4
N$66  (via drill 0.4)
  Top 0.2: v84.4,31 82.27,31 DI8.2
  Bottom 0.2: IC6.18 87.88,8.32 86.4,9.8 86.4,13.6 85,15 85,25.2 85.6,25.8 85.6,29.8 v84.4,31
N$67  (via drill 0.4)
  Top 0.2: v84.6,26 DI8.11
  Bottom 0.2: IC6.19 87.92,7.68 86,9.6 86,13.4 84.6,14.8 v84.6,26
N$68
  Bottom 0.2: IC6.20 87.75,7.05 85.6,9.2 85.6,13.2 84.2,14.6 84.2,20.4 83.8,20.8 82.31,20.8 DI8.6
N$69
  Bottom 0.2: IC2.8 99.59,18.45 R8.2
N$70
  Bottom 0.2: Q1.1 101.48,16.35 R8.1 | C5.2 101.93,15.12 Q1.1 | R9.1 101.93,18.58 Q1.1
N$71
  Bottom 0.2: IC2.7 99.37,19.8 103.8,19.8 104.05,19.55 R9.2 104.05,17.22 Q1.2 104.2,16.53 C4.2
N$72  (via drill 0.4)
  Top 0.2: v91.4,29.8 87.4,29.8 86.8,30.4 v86.8,30.6
  Bottom 0.2: IC2.18 91.4,27.77 v91.4,29.8 | v86.8,30.6 86.8,34.4 85.6,35.6 74.6,35.6 73.4,36.8 R7.2
N$73
  Bottom 0.2: IC3.2 23.86,5.14 22.4,6.6 21.6,6.6 21.2,7 13,7 12.78,6.78 IC1.22
N$74
  Bottom 0.2: IC4.2 42.26,5.14 40.8,6.6 35.6,6.6 34.78,5.78 IC3.22
N$75
  Bottom 0.2: IC6.2 82.06,5.14 80.6,6.6 59.4,6.6 58.58,5.78 IC4.22
N$76  (via drill 0.4)
  Top 0.2: LED2.C 97.75,27.75 v97.2,27.2
  Bottom 0.2: v97.2,27.2 97.2,30.4 97,30.6 R2.1
N$77
  Bottom 0.2: IC2.23 94.45,30.38 R5.1
N$78
  Bottom 0.2: IC2.24 95.6,30.36 95.6,33.8 95.4,34 R4.1
N$79  (via drill 0.4)
  Top 0.2: X1.3 80.27,37.33 80.6,37 90.6,37 91.6,36 91.6,33.6 v91,33
  Bottom 0.2: v91,33 91,32.2 91.4,31.8 R5.2
N$80  (via drill 0.4)
  Top 0.2: X1.2 77.73,37.27 78.4,36.6 89.6,36.6 v90.8,35.4
  Bottom 0.2: R4.2 91.4,34.2 90.8,34.8 v90.8,35.4
N$81
  Bottom 0.2: IC2.32 103.55,27.19 JP1.4
N$82
  Bottom 0.2: IC2.31 104.96,29.73 JP1.3
N$83  (via drill 0.4)
  Top 0.2: v93.6,30.4 94.25,29.75 LED2.A
  Bottom 0.2: IC2.21 93.6,28.97 v93.6,30.4
N$84  (via drill 0.4)
  Top 0.2: v103.2,29.6 103.8,29.6 104.2,29.2 104.2,24.8 v104,24.6
  Bottom 0.2: LED1.C 103.05,29.75 v103.2,29.6 | v104,24.6 R1.1
N$85
  Bottom 0.4: C15.2 58.05,40.95 57.5,41.5 47.5,41.5
  pour Bottom: 36.5,43 36.5,37.7 38.8,37.7 40.8,39.7 47.8,39.7 47.8,43
N$86
  Bottom 0.2: 55.85,39.91 C15.1
  Bottom 0.4: IC7.1 55.85,39.91
N$87
  Bottom 0.2: IC2.25 99.24,30.8 LED1.A
N$88
  Bottom 0.2: 42.05,31 R22.2 | R21.1 R22.2 | IC7.5 47.4,32.6 46.8,32 44.8,32 43.8,31 42.65,31 R22.2
N$89
  Bottom 0.2: R21.2 R20.1
N$90
  Bottom 0.2: C12.1 R17.2
N$91
  Bottom 0.2: IC7.6 48.63,37.37 49.2,36.8 49.2,35.6 50.4,34.4 51.45,34.4 C13.2
  Bottom 0.3: C13.2 51.75,33.25 52,33 52.8,33 53,32.8 C12.2
N$92
  Bottom 0.3: IC7.4 56.26,36.09 C10.2
N$93  (via drill 0.4)
  Top 0.2: LED3.C 97.75,19.75 v96.2,18.2
  Bottom 0.2: v96.2,18.2 96.2,16.05 R3.1
N$94  (via drill 0.4)
  Top 0.2: v94.2,24.8 94.25,24.75 LED3.A
  Bottom 0.2: IC2.22 95.6,28.1 95.6,26.8 94.2,25.4 v94.2,24.8
V+  (via drill 0.4)
  Bottom 0.4: DI1.14 DI1.1 4,32.43 4,29 4.46,28.54 DI1.3
  other vias: 20.8,36.8 22,36.8 23.2,36.8 21.4,37.6 22.6,37.6 20.8,38.4 22,38.4 23.2,38.4 20.2,37.6 23.8,37.6
  pour Top: 12,17 93,17 93,35 24.1,35 24.1,39.5 19.7,39.5 19.7,35 12,35
  pour Bottom: 83,31 83,16 14,16 14,31
  pour Bottom: 19.9,43 19.9,36.7 24,36.7 24,39.2 28.8,39.2 30.3,37.7 35.5,37.7 35.5,43
(copper drawn outside any net)
  shapes: Bottom circle x1